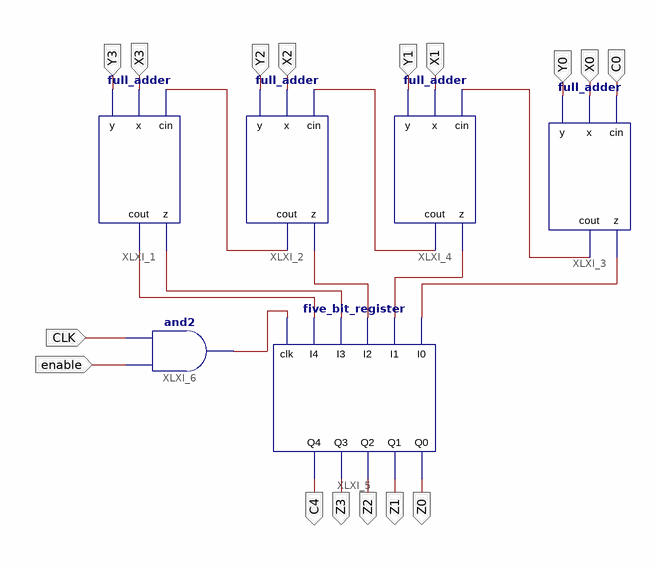
[diagram p0: schematic sheet 1]
// Xilinx ISE schematic four_bit_ripple_carry_adder.sch (spartan3e) as structural Verilog: 6 symbols, 16 ports
module four_bit_ripple_carry_adder (
  input  C0,
  input  X0,
  input  Y0,
  input  X1,
  input  Y1,
  input  X2,
  input  Y2,
  input  X3,
  input  Y3,
  input  CLK,
  input  enable,
  output Z0,
  output Z1,
  output Z2,
  output Z3,
  output C4
);

  wire XLXN_1, XLXN_2, XLXN_3, XLXN_4, XLXN_5, XLXN_6, XLXN_7, XLXN_46, XLXN_47;

  full_adder XLXI_1 (.cin(XLXN_3), .cout(XLXN_46), .x(X3), .y(Y3), .z(XLXN_7));
  full_adder XLXI_2 (.cin(XLXN_2), .cout(XLXN_3), .x(X2), .y(Y2), .z(XLXN_6));
  full_adder XLXI_4 (.cin(XLXN_1), .cout(XLXN_2), .x(X1), .y(Y1), .z(XLXN_5));
  full_adder XLXI_3 (.cin(C0), .cout(XLXN_1), .x(X0), .y(Y0), .z(XLXN_4));
  five_bit_register XLXI_5 (
    .I2(XLXN_6), .I1(XLXN_5), .I4(XLXN_46), .I3(XLXN_7), .I0(XLXN_4), .clk(XLXN_47), .Q0(Z0), .Q4(C4),
    .Q3(Z3), .Q2(Z2), .Q1(Z1));
  and XLXI_6 (XLXN_47, enable, CLK);
endmodule
